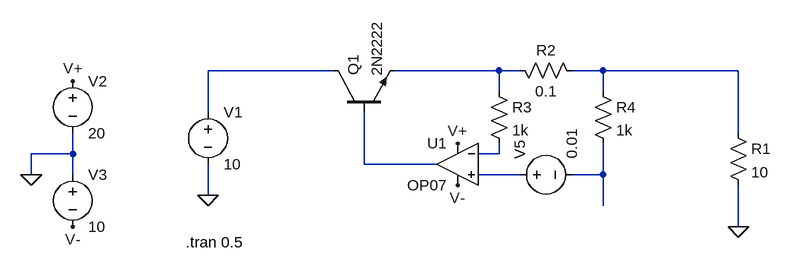
[diagram p0: schematic clim.asc]
clim.asc, the LTspice schematic file:
Version 4
SHEET 1 880 704
WIRE 160 160 -32 160
WIRE 416 160 256 160
WIRE 448 160 416 160
WIRE 576 160 528 160
WIRE 784 160 576 160
WIRE 416 192 416 160
WIRE 576 192 576 160
WIRE -32 224 -32 160
WIRE 784 256 784 160
WIRE -240 288 -240 256
WIRE -240 288 -304 288
WIRE 416 288 416 272
WIRE 416 288 384 288
WIRE 208 304 208 224
WIRE 320 304 208 304
WIRE -304 320 -304 288
WIRE -240 320 -240 288
WIRE 448 320 384 320
WIRE 576 320 576 272
WIRE 576 320 528 320
WIRE -32 352 -32 304
WIRE 576 368 576 320
WIRE 784 400 784 336
FLAG -32 352 0
FLAG 784 400 0
FLAG -304 320 0
FLAG -240 176 V+
FLAG 352 272 V+
FLAG -240 400 V-
FLAG 352 336 V-
SYMBOL npn3 160 224 R270
SYMATTR InstName Q1
SYMATTR Value 2N2222
SYMBOL res 768 240 R0
SYMATTR InstName R1
SYMATTR Value 10
SYMBOL res 432 144 M90
WINDOW 0 0 56 VBottom 2
WINDOW 3 32 56 VTop 2
SYMATTR InstName R2
SYMATTR Value 0.1
SYMBOL Opamps\\OP07 352 240 M0
SYMATTR InstName U1
SYMBOL res 400 176 R0
SYMATTR InstName R3
SYMATTR Value 1k
SYMBOL res 560 176 R0
SYMATTR InstName R4
SYMATTR Value 1k
SYMBOL voltage -32 208 R0
WINDOW 123 0 0 Left 2
WINDOW 39 0 0 Left 2
SYMATTR InstName V1
SYMATTR Value 10
SYMBOL voltage -240 160 R0
WINDOW 123 0 0 Left 2
WINDOW 39 0 0 Left 2
SYMATTR InstName V2
SYMATTR Value 20
SYMBOL voltage -240 304 R0
WINDOW 123 0 0 Left 2
WINDOW 39 0 0 Left 2
SYMATTR InstName V3
SYMATTR Value 10
SYMBOL voltage 432 320 R270
WINDOW 123 0 0 Left 2
WINDOW 39 0 0 Left 2
SYMATTR InstName V5
SYMATTR Value 0.01
TEXT -66 424 Left 2 !.tran 0.5

The netlist it stands for:
* clim.asc
Q1 N001 N005 N002 0 2N2222
R1 N003 0 10
R2 N002 N003 0.1
XU1 N006 N004 V+ V- N005 LT1001  ; OP07, pins In+ In- V+ V- OUT
R3 N002 N004 1k
R4 N003 N007 1k
V1 N001 0 10
V2 V+ 0 20
V3 0 V- 10
V5 N006 N007 0.01
.model NPN NPN
.model PNP PNP
.lib standard.bjt
.tran 0.5
.lib LTC.lib
.backanno
.end